# Altium schematic sheet 05_RS485.SchDoc
size A4; Revision: A
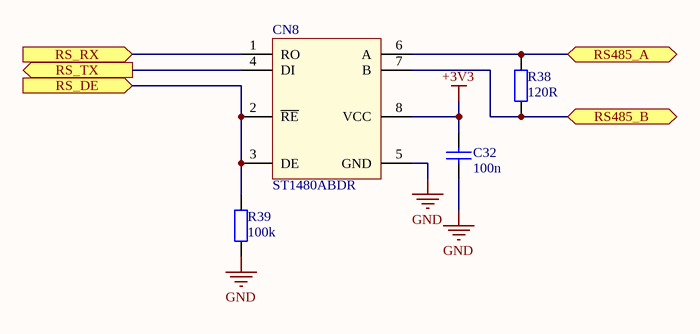
[diagram p0: 05_RS485.SchDoc]

## Parts
C32  100n  [C0603_IPC_MD]
CN8  ST1480ABDR  [SOIC-8]
R38  120R  [R0603_IPC_MD]
R39  100k  [R0603_IPC_MD]

## Ports
RS485_A (bidir), RS485_B (bidir), RS_DE (in), RS_RX (in), RS_TX (out)

## Nets
+3V3: C32.2 CN8.8(VCC)
GND: C32.1 CN8.5(GND) R39.1
RS485_A: CN8.6(A) R38.2 ; port RS485_A
RS485_B: CN8.7(B) R38.1 ; port RS485_B
RS_DE: CN8.2(~{RE}) CN8.3(DE) R39.2 ; port RS_DE
RS_RX: CN8.1(RO) ; port RS_RX
RS_TX: CN8.4(DI) ; port RS_TX

## Notes on the sheet
- Title
- Size:
- Date:
- A4
- Number:
- Time:
- Revision:
- Sheet
- of
- File:

## Library data of the parts
C32 = CL10B104KO8WPNC: CAP CER 0.1UF 16V X7R 0603; Manufacturer: Samsung Electro-Mechanics; Manufacturer Part Number: CL10B104KO8WPNC; Voltage: 16V; Value: 100n; Dielectric: X7R; Supplier 1: Digi-Key; Supplier Part Number 1: 1276-6582-1-ND
CN8 = ST1480ABDR: IC TXRX 3.3V RS485/422 8 SOIC; Manufacturer: STMicroelectronics; Manufacturer Part Number: ST1480ABDR; Supplier 1: Digi-Key; Supplier Part Number 1: 497-2046-1-ND
R38 = RC0603JR-07120RL: RES SMD 120 OHM 5% 1/10W 0603; Manufacturer: Yageo; Value: 120R; Tolarance: 5%; Manufacturer Part Number: RC0603JR-07120RL; Supplier 1: Digi-Key; Supplier Part Number 1: 311-120GRCT-ND
R39 = RMCF0603FT100K: RES 100K OHM 1% 1/10W 0603; Manufacturer: Bourns Inc.; Value: 100k; Tolarance: 1%; Manufacturer Part Number: RMCF0603FT100K; Supplier 1: Digi-Key; Supplier Part Number 1: RMCF0603FT100KCT-ND